# EAGLE design e1_tap (EAGLE 7.6.0)
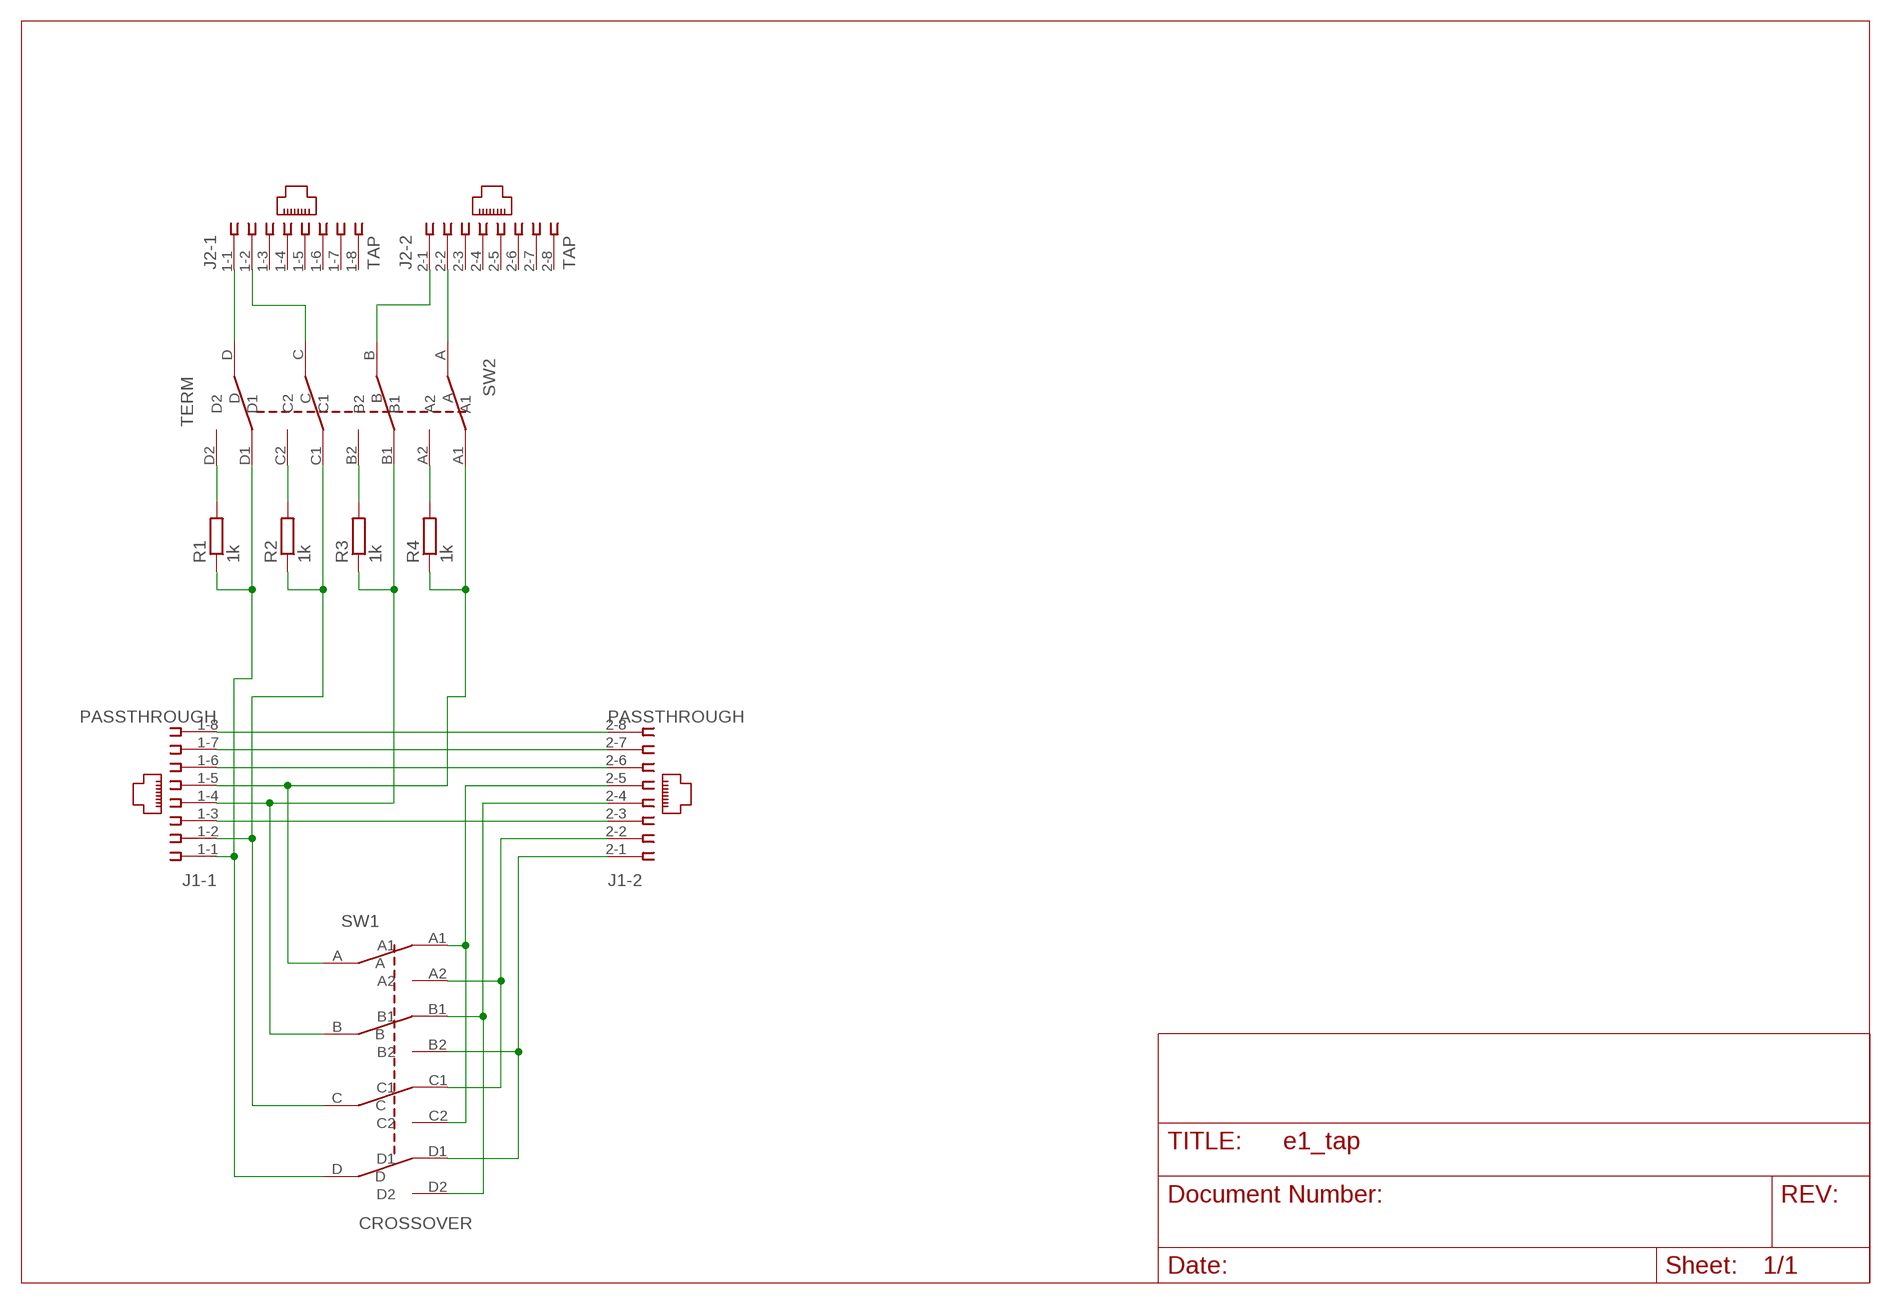
[diagram p0: schematic, sheet 1]

## Parts
J1  PASSTHROUGH  557560-1  [557560-1]
J2  TAP  557560-1  [557560-1]
R1  1k  R-EU_R0603  [R0603]
R2  1k  R-EU_R0603  [R0603]
R3  1k  R-EU_R0603  [R0603]
R4  1k  R-EU_R0603  [R0603]
SW1  CROSSOVER  SWITCH_4PDT  [4PDT_DIL12]
SW2  TERM  SWITCH_4PDT  [4PDT_DIL12]

## Nets
CROSS: J1.2-4 SW1.B1 SW1.D2
N$1: J1.1-8 J1.2-8
N$2: J1.1-7 J1.2-7
N$3: J1.1-6 J1.2-6
N$4: J1.1-3 J1.2-3
N$5: J1.1-2 R2.1 SW1.C SW2.C1
N$6: J1.1-1 R1.1 SW1.D SW2.D1
N$7: J1.1-4 R3.1 SW1.B SW2.B1
N$8: J1.1-5 R4.1 SW1.A SW2.A1
N$9: J1.2-5 SW1.A1 SW1.C2
N$10: J2.1-1 SW2.D
N$11: J1.2-2 SW1.A2 SW1.C1
N$12: J1.2-1 SW1.B2 SW1.D1
N$13: J2.1-2 SW2.C
N$14: J2.2-1 SW2.B
N$15: J2.2-2 SW2.A
N$16: R1.2 SW2.D2
N$17: R2.2 SW2.C2
N$18: R3.2 SW2.B2
N$19: R4.2 SW2.A2
Unconnected: J2.1-3 J2.1-4 J2.1-5 J2.1-6 J2.1-7 J2.1-8 J2.2-3 J2.2-4 J2.2-5 J2.2-6 J2.2-7 J2.2-8

## Library data of the parts
J1 J2 = con-amp:557560-1: AMP connector; CLASS: CONNECTOR\JUMPER; DESCRIPTION: CONN MOD JACK 8P8C R/A UNSHLD; LINK: https://www.digikey.de/product-detail/en/te-connectivity-amp-connectors/5557560-1/A31449-ND/769593; MANUFACTURER: TE Connectivity AMP Connectors; MANUFACTURERPARTNUMBER: 5557560-1; POPULATED: TRUE; ROHSCERTIFICATE: UNKNOWN ROHS CERTIFICATE; SOURCE: DIGIKEY; SOURCEPARTNUMBER: A31449-ND
R1-R4 = rcl:R-EU_: RESISTOR, European symbol; CLASS: RESISTOR; DESCRIPTION: RES SMD 1K OHM 1% 1/10W 0603; LINK: https://www.digikey.de/product-detail/en/yageo/RC0603FR-071KL/311-1.00KHRCT-ND/729790; MANUFACTURER: Yageo; MANUFACTURERPARTNUMBER: RC0603FR-071KL; POPULATED: TRUE; ROHSCERTIFICATE: UNKNOWN ROHS CERTIFICATE; SOURCE: DIGIKEY; SOURCEPARTNUMBER: 311-1.00KHRCT-ND
SW1 SW2 = laforge:SWITCH_4PDT; CLASS: UNKNOWN CLASS; DESCRIPTION: SWITCH SLIDE 4PDT 300MA 115V; LINK: https://www.digikey.de/product-detail/en/te-connectivity-alcoswitch-switches/1-1825010-3/450-1633-ND/1202112; MANUFACTURER: TE Connectivity ALCOSWITCH Switches; MANUFACTURERPARTNUMBER: 1-1825010-3; POPULATED: TRUE; ROHSCERTIFICATE: UNKNOWN ROHS CERTIFICATE; SOURCE: DIGIKEY; SOURCEPARTNUMBER: 450-1633-ND

## Board
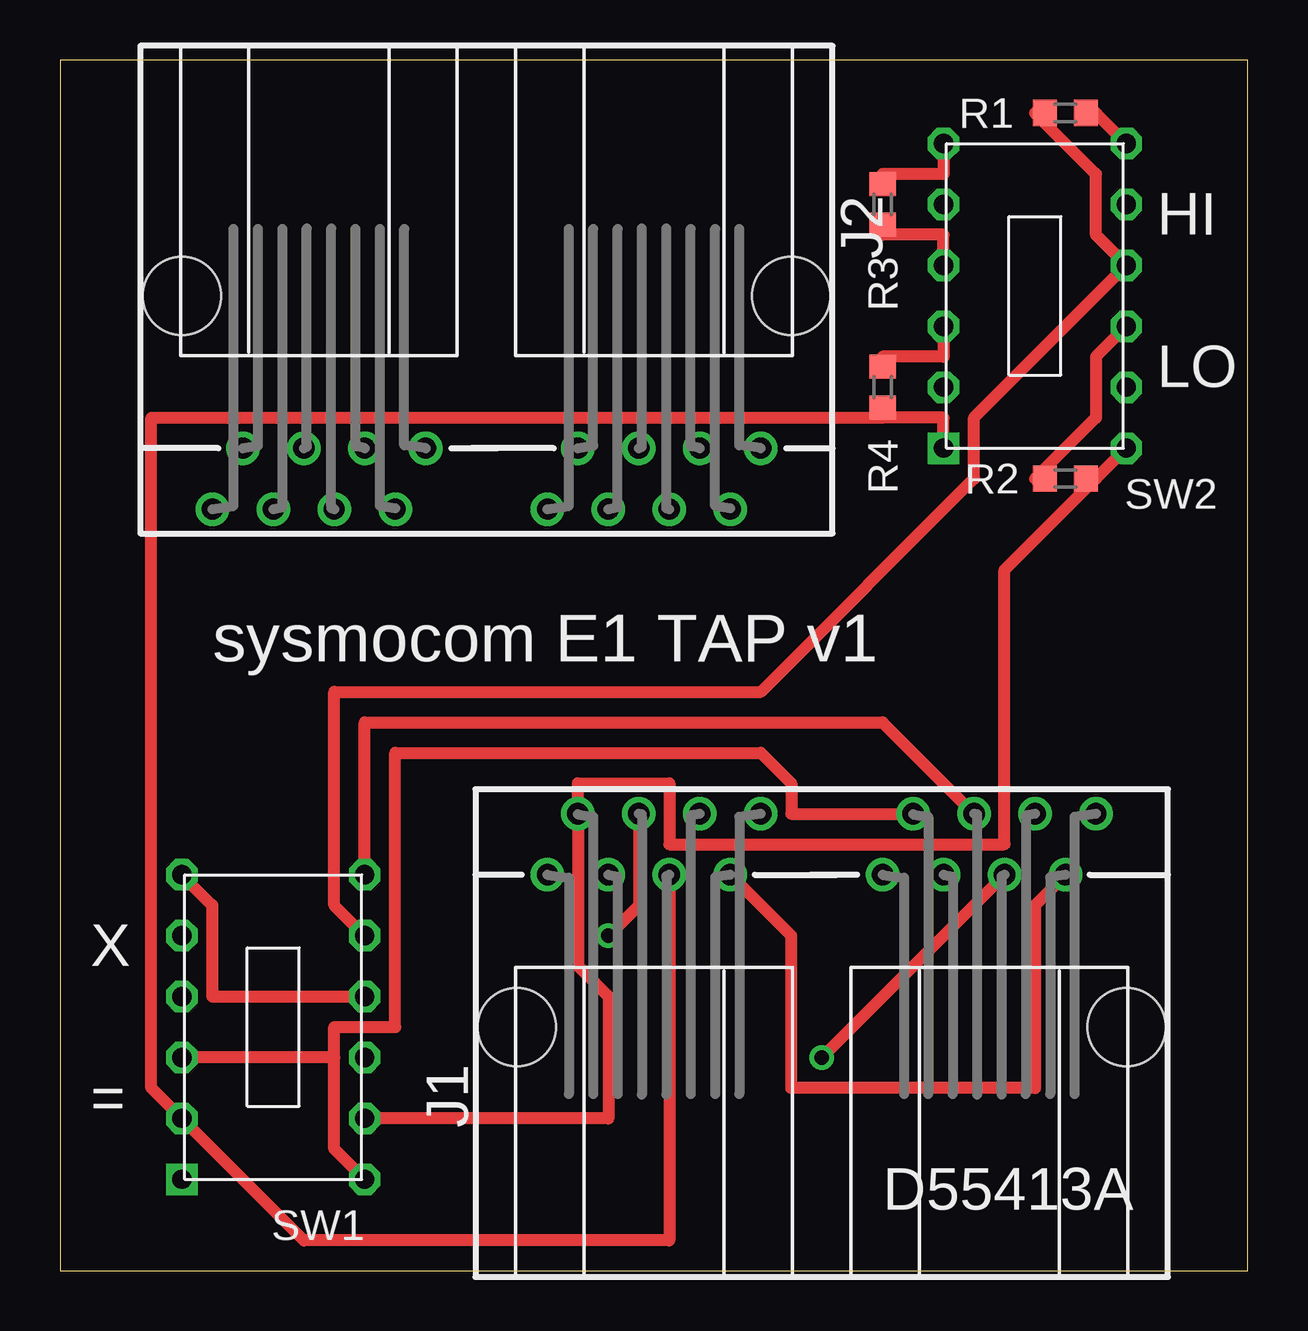
[diagram p1: board, top side]
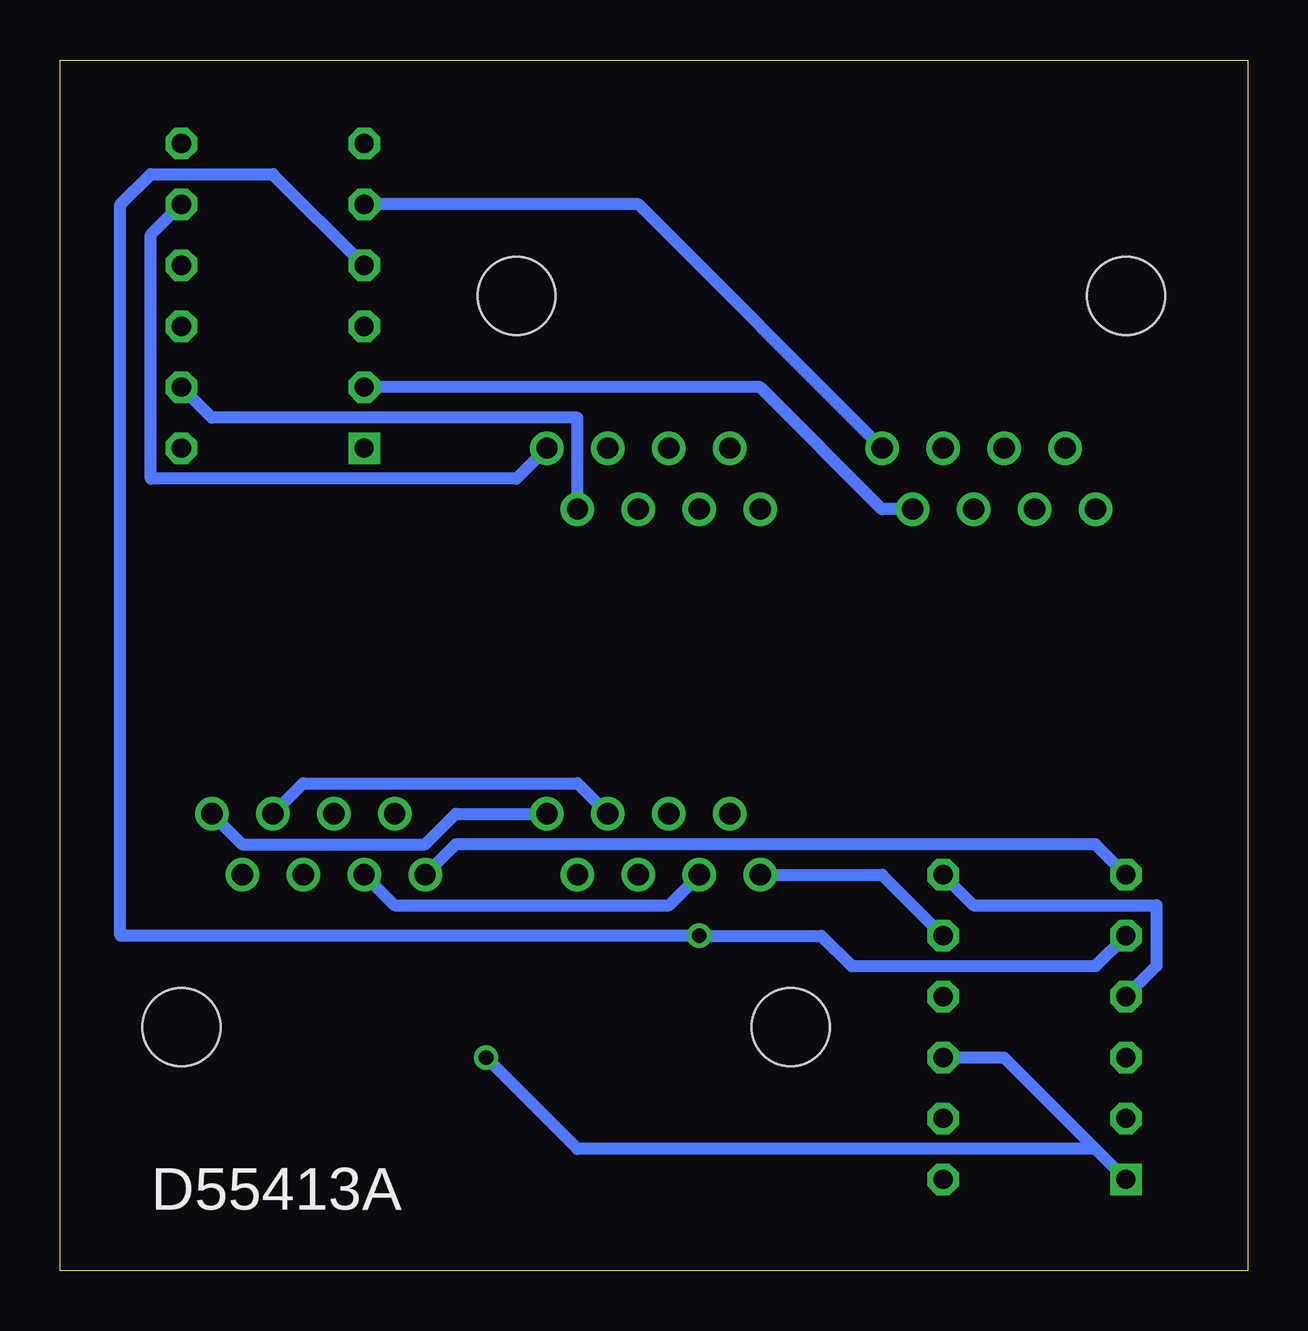
[diagram p2: board, bottom side, seen from below]

Size 49.51 x 50.47 mm. Coordinates in mm from the lower left corner, seen from the top.
Outline: 0,0 49.51,0 49.51,50.47 0,50.47 0,0
Copper layers (1*16): Top 0.035mm / dielectric 1.5mm / Bottom 0.035mm
Design rules "default": minimum track width 20mil, minimum drill 24mil, track to track 8mil, track to pad 8mil, pad to pad 8mil, via to via 8mil, smd to smd 8mil, copper to edge 40mil, drill to drill 8mil, minimum pad ring 10mil, minimum via ring 8mil, stop-mask expansion 4mil, vias tented up to drill 0mil, thermal gap 10mil

### Footprints (pad centres in the part's own frame; a part is rotated, then mirrored left to right if it is on the bottom)
557560-1 = drill 0.889: 1-1 -11.43,6.35; 1-2 -10.16,8.89; 1-3 -8.89,6.35; 1-4 -7.62,8.89; 1-5 -6.35,6.35; 1-6 -5.08,8.89; 1-7 -3.81,6.35; 1-8 -2.54,8.89; 2-1 2.54,6.35; 2-2 3.81,8.89; 2-3 5.08,6.35; 2-4 6.35,8.89; 2-5 7.62,6.35; 2-6 8.89,8.89; 2-7 10.16,6.35; 2-8 11.43,8.89 | hole 3.251: -12.7,0; 12.7,0
R0603 = smd 1 x 1.1: 1 -0.85,0; 2 0.85,0
4PDT_DIL12 = drill 0.8 octagon: A -3.81,3.81; A2 -1.27,3.81; B 3.81,3.81; B1 1.27,3.81; B2 6.35,3.81; C -3.81,-3.81; C1 -6.35,-3.81; C2 -1.27,-3.81; D 3.81,-3.81; D1 1.27,-3.81; D2 6.35,-3.81 | drill 0.8 square: A1 -6.35,3.81

### Placement (x,y rotation side)
J1  31.75,10.16 0 top
J2  17.78,40.64 180 top
R1  41.91,48.26 0 top
R2  41.91,33.02 180 top
R3  34.29,44.45 90 top
R4  34.29,36.83 90 top
SW1  8.89,10.16 90 top
SW2  40.64,40.64 90 top

### Tracks (layer width: path | path; a pad name or v marks a point on that pad's centre or on a via)
CROSS
  Top 0.508: J1.2-4 34.29,22.86 12.7,22.86 SW1.D2
  Bottom 0.508: SW1.B1 3.81,12.7 3.81,15.24 11.43,15.24 SW1.D2
N$1
  Bottom 0.508: J1.1-8 33.02,19.05 34.29,17.78 41.91,17.78 J1.2-8
N$2
  Top 0.508: J1.1-7 30.48,13.97 30.48,7.62 40.64,7.62 40.64,15.24 J1.2-7
N$3
  Bottom 0.508: J1.1-6 27.94,20.32 39.37,20.32 J1.2-6
N$4
  Bottom 0.508: J1.1-3 24.13,15.24 35.56,15.24 J1.2-3
N$5
  Top 0.508: SW2.C1 43.18,33.02 | SW1.C 22.86,6.35 22.86,11.43 21.59,12.7 J1.1-2 21.59,20.32 25.4,20.32 25.4,17.78 39.37,17.78 39.37,29.21 43.18,33.02 | 43.18,33.02 R2.1
N$6
  Top 0.508: R1.1 40.64,48.26 43.18,45.72 43.18,43.18 SW2.D1 38.1,35.56 38.1,33.02 29.21,24.13 11.43,24.13 11.43,15.24 SW1.D
  Bottom 0.508: SW1.D 15.24,16.51 J1.1-1
N$7  (via drill 0.61)
  Top 0.508: SW2.B1 36.83,43.18 34.29,43.18 R3.1 | v22.86,13.97 24.13,15.24 J1.1-4
  Bottom 0.508: SW1.B 6.35,12.7 16.51,12.7 17.78,13.97 v22.86,13.97 46.99,13.97 46.99,44.45 45.72,45.72 40.64,45.72 SW2.B1
N$8
  Top 0.508: 34.29,35.56 36.83,35.56 SW2.A1 | J1.1-5 25.4,1.27 10.16,1.27 SW1.A 3.81,7.62 3.81,35.56 34.29,35.56 | 34.29,35.56 R4.1
N$9  (via drill 0.61)
  Top 0.508: v31.75,8.89 J1.2-5
  Bottom 0.508: 6.35,5.08 10.16,8.89 SW1.C2 | 6.35,5.08 SW1.A1 | v31.75,8.89 27.94,5.08 6.35,5.08
N$10
  Bottom 0.508: SW2.D 45.72,43.18 45.72,33.02 30.48,33.02 J2.1-1
N$11
  Top 0.508: 11.43,8.89 SW1.A2 | 11.43,8.89 11.43,5.08 SW1.C1 | J1.2-2 30.48,19.05 30.48,20.32 29.21,21.59 13.97,21.59 13.97,10.16 11.43,10.16 11.43,8.89
N$12
  Top 0.508: SW1.D1 6.35,11.43 6.35,15.24 SW1.B2
  Bottom 0.508: J1.2-1 33.02,17.78 6.35,17.78 SW1.B2
N$13
  Bottom 0.508: SW2.C 43.18,35.56 27.94,35.56 J2.1-2
N$14
  Bottom 0.508: SW2.B 25.4,44.45 J2.2-1
N$15
  Bottom 0.508: SW2.A 20.32,36.83 15.24,31.75 J2.2-2
N$16
  Top 0.508: SW2.D2 43.18,48.26 R1.2
N$17
  Top 0.508: SW2.C2 43.18,38.1 43.18,35.56 40.64,33.02 R2.2
N$18
  Top 0.508: SW2.B2 36.83,45.72 34.29,45.72 R3.2
N$19
  Top 0.508: SW2.A2 36.83,38.1 34.29,38.1 R4.2

### Text on the board
tNames: HI | LO | sysmocom E1 TAP v1 | X | = | D55413A
bNames: D55413A